# Altium schematic sheet 5_Digitrol.SchDoc
size A3; DocumentNumber: 5; SheetNumber: 5; SheetTotal: 6
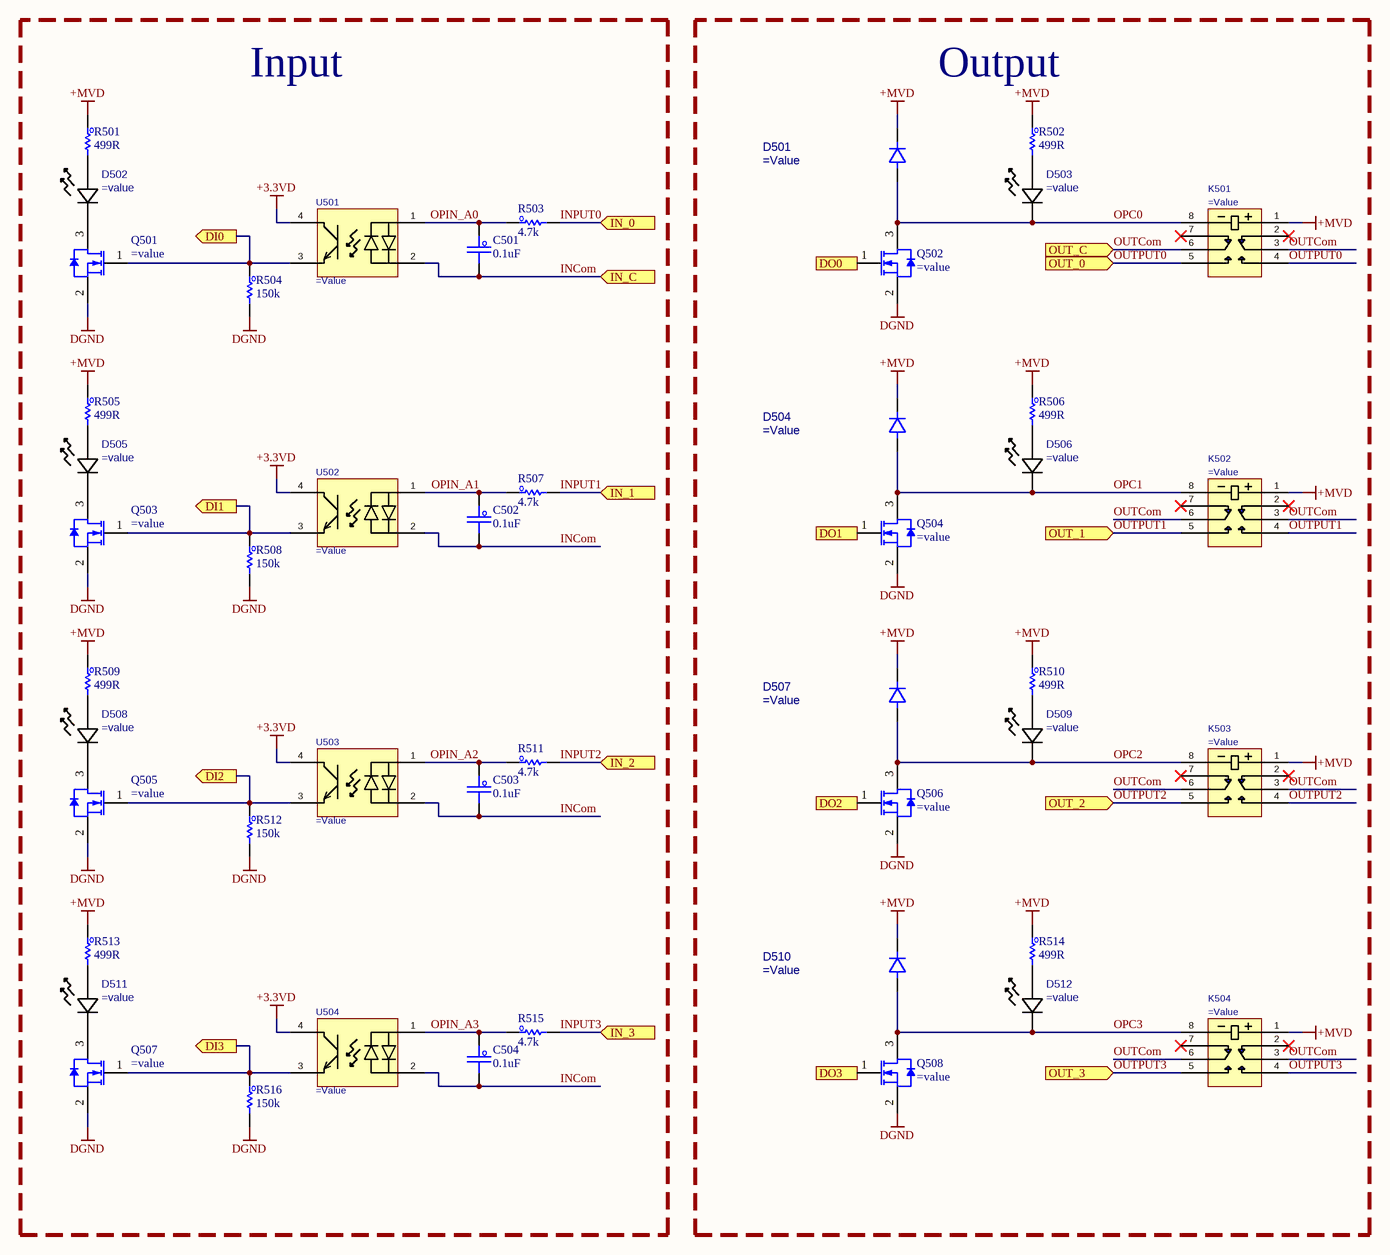
[diagram p0: 5_Digitrol.SchDoc]

## Parts
C501  0.1uF  [C_0603]
C502  0.1uF  [C_0603]
C503  0.1uF  [C_0603]
C504  0.1uF  [C_0603]
D501  (no value)  [DFN119P160X30-2M]
D502  (no value)  [LED_0VS75000_WRE]
D503  (no value)  [LED_0VS75000_WRE]
D504  (no value)  [DFN119P160X30-2M]
D505  (no value)  [LED_0VS75000_WRE]
D506  (no value)  [LED_0VS75000_WRE]
D507  (no value)  [DFN119P160X30-2M]
D508  (no value)  [LED_0VS75000_WRE]
D509  (no value)  [LED_0VS75000_WRE]
D510  (no value)  [DFN119P160X30-2M]
D511  (no value)  [LED_0VS75000_WRE]
D512  (no value)  [LED_0VS75000_WRE]
K501  (no value)  [RELAY_HFD4/12-SR]
K502  (no value)  [RELAY_HFD4/12-SR]
K503  (no value)  [RELAY_HFD4/12-SR]
K504  (no value)  [RELAY_HFD4/12-SR]
Q501  (no value)  [SOT95P245X110-3M]
Q502  (no value)  [SOT95P245X110-3M]
Q503  (no value)  [SOT95P245X110-3M]
Q504  (no value)  [SOT95P245X110-3M]
Q505  (no value)  [SOT95P245X110-3M]
Q506  (no value)  [SOT95P245X110-3M]
Q507  (no value)  [SOT95P245X110-3M]
Q508  (no value)  [SOT95P245X110-3M]
R501  499R  [R_0603]
R502  499R  [R_0603]
R503  4.7k  [R_0603]
R504  150k  [R_0603]
R505  499R  [R_0603]
R506  499R  [R_0603]
R507  4.7k  [R_0603]
R508  150k  [R_0603]
R509  499R  [R_0603]
R510  499R  [R_0603]
R511  4.7k  [R_0603]
R512  150k  [R_0603]
R513  499R  [R_0603]
R514  499R  [R_0603]
R515  4.7k  [R_0603]
R516  150k  [R_0603]
U501  (no value)  [LTV-814S_LTO]
U502  (no value)  [LTV-814S_LTO]
U503  (no value)  [LTV-814S_LTO]
U504  (no value)  [LTV-814S_LTO]

## Blocks framed on the sheet
Input: C501-C504 D502 D505 D508 D511 Q501 Q503 Q505 Q507 R501 R503-R505 R507-R509 R511-R513 R515 R516 U501-U504
Output: D501 D503 D504 D506 D507 D509 D510 D512 K501-K504 Q502 Q504 Q506 Q508 R502 R506 R510 R514

## Ports
DI0 (out), DI1 (out), DI2 (out), DI3 (out), DO0 (in), DO1 (in), DO2 (in), DO3 (in), IN_0 (in), IN_1 (in), IN_2 (in), IN_3 (in), IN_C (in), OUT_0 (in), OUT_1 (in), OUT_2 (in), OUT_3 (in), OUT_C (in)

## Nets
+3.3VD: U501.4(C) U502.4(C) U503.4(C) U504.4(C)
+MVD: D501.1 D504.1 D507.1 D510.1 K501.1 K502.1 K503.1 K504.1 R501.1 R502.1 R505.1 R506.1 R509.1 R510.1 R513.1 R514.1
DGND: Q501.2(S) Q502.2(S) Q503.2(S) Q504.2(S) Q505.2(S) Q506.2(S) Q507.2(S) Q508.2(S) R504.2 R508.2 R512.2 R516.2
DI0: Q501.1(G) R504.1 U501.3(E) ; port DI0
DI1: Q503.1(G) R508.1 U502.3(E) ; port DI1
DI2: Q505.1(G) R512.1 U503.3(E) ; port DI2
DI3: Q507.1(G) R516.1 U504.3(E) ; port DI3
DO0: Q502.1(G) ; port DO0
DO1: Q504.1(G) ; port DO1
DO2: Q506.1(G) ; port DO2
DO3: Q508.1(G) ; port DO3
INCom: C501.2 C502.2 C503.2 C504.2 U501.2(C_2) U502.2(C_2) U503.2(C_2) U504.2(C_2) ; port IN_C
INPUT0: R503.2 ; port IN_0
INPUT1: R507.2 ; port IN_1
INPUT2: R511.2 ; port IN_2
INPUT3: R515.2 ; port IN_3
OPC0: D501.2 D503.1 K501.8 Q502.3(D)
OPC1: D504.2 D506.1 K502.8 Q504.3(D)
OPC2: D507.2 D509.1 K503.8 Q506.3(D)
OPC3: D510.2 D512.1 K504.8 Q508.3(D)
OPIN_A0: C501.1 R503.1 U501.1(A)
OPIN_A1: C502.1 R507.1 U502.1(A)
OPIN_A2: C503.1 R511.1 U503.1(A)
OPIN_A3: C504.1 R515.1 U504.1(A)
OUTCom: K501.3 K501.6 K502.3 K502.6 K503.3 K503.6 K504.3 K504.6 ; port OUT_C
OUTPUT0: K501.4 K501.5 ; port OUT_0
OUTPUT1: K502.4 K502.5 ; port OUT_1
OUTPUT2: K503.4 K503.5 ; port OUT_2
OUTPUT3: K504.4 K504.5 ; port OUT_3
NetD502_1: D502.1 Q501.3(D)
NetD502_2: D502.2 R501.2
NetD503_2: D503.2 R502.2
NetD505_1: D505.1 Q503.3(D)
NetD505_2: D505.2 R505.2
NetD506_2: D506.2 R506.2
NetD508_1: D508.1 Q505.3(D)
NetD508_2: D508.2 R509.2
NetD509_2: D509.2 R510.2
NetD511_1: D511.1 Q507.3(D)
NetD511_2: D511.2 R513.2
NetD512_2: D512.2 R514.2

Not connected (* = marked no-connect by the designer): K501 2* 7*; K502 2* 7*; K503 2* 7*; K504 2* 7*

## Notes on the sheet
- Title :
- Revision :
- ผู้จัดทำ:
- Size:
- A3
- Time:
- ผู้เขียน:
- บริษัท ยูนิเวอร์แซล ยูทีลิตี้ส์ จำกัด (มหาชน) เลขที่ 1 อาคาร อีสท์วอเตอร์ ชั้น 18 ซอยวิภาวดีรังสิต 5 แขวงจอมพล เขตจตุจักร กรุงเทพฯ 10900
  Tel : +662-272-1688
  Fax :+662-2721690-1
- -
- Sheet:
- of
- ผู้อำนวยการ
- ผู้ตรวจสอบ:
- Number:
- กรรมการผู้จัดการ:
- File:

## Library data of the parts
C501-C504 = C_Capacitor: CAP CER 0.1UF 50V X7R 0603; Manufacturer: KEMET; PartNumber: C0603C104K5RACTU; PackageReference: 0603; PartID: 399-5089-1-ND; Value2: 50V; Value: 0.1uF; Value3: *
D501 D504 D507 D510 = D_PW_VSKY20301608: DIODE SCHOTTKY 30V 2A 0603; Manufacturer: Vishay General Semiconductor - Diodes Division; Value: VSKY20301608-G4-08; PackageReference: 0603; PartID: 112-VSKY20301608-G4-08CT-ND; PartNumber: VSKY20301608-G4-08
D502 D503 D505 D506 D508 D509 D511 D512 = D_LED_150060BS75000: LED BLUE CLEAR 0603 SMD; Manufacturer: Wurth Electronics; Value: 150060VS75000; PackageReference: 0603; PartID: 732-4980-1-ND; PartNumber: 150060VS75000
K501-K504 = SW_RELAY_HFD4/12-SR: Telecom Non Latching 12VDC DPDT SMD Relays RoHS; Manufacturer: Xiamen Hongfa Electroacoustic; Value: HFD4/5-SR; PackageReference: *; PartID: C64399; PartNumber: HFD4/5-SR
Q501-Q508 = Q_NMOS_2N7002H: MOSFET N-CH 60V 300MA SOT23-3; Manufacturer: Infineon Technologies; Value: 2N7002H6327XTSA2; PackageReference: SOT23; PartID: 2N7002H6327XTSA2CT-ND; PartNumber: 2N7002H6327XTSA2; Value3: *
R501 R502 R505 R506 R509 R510 R513 R514 = R_Resister: RES 499 OHM 1% 1/10W 0603; Manufacturer: Vishay Dale; PartNumber: CRCW0603499RFKEAC; Value2: 0.1W; Value: 499R; PackageReference: 0603; PartID: 541-3986-1-ND; Value3: *
R503 R507 R511 R515 = R_Resister: RES 4.7K OHM 5% 1/10W 0603; Manufacturer: Vishay Dale; PartNumber: CRCW06034K70JNEBC; Value2: 0.1W; Value: 4.7k; PackageReference: 0603; PartID: 541-CRCW06034K70JNEBCCT-ND; Value3: *
R504 R508 R512 R516 = R_Resister: RES SMD 150K OHM 1% 1/10W 0603; Manufacturer: Vishay Dale; PartNumber: CRCW0603150KFKEAC; Value2: 0.1W; Value: 150k; PackageReference: 0603; PartID: 541-4034-1-ND; Value3: *
U501-U504 = IC_OPTO_LTV-814S-TA1: OPTOISOLATR 5KV TRANSISTOR 4-SMD; Manufacturer: Lite-On Inc.; Value: LTV-814S-TA1; PackageReference: 4-SOP; PartID: 160-1891-1-ND; PartNumber: LTV-814S-TA1